# Altium schematic sheet Bridge.SchDoc
size A4; SheetNumber: 2; SheetTotal: 4
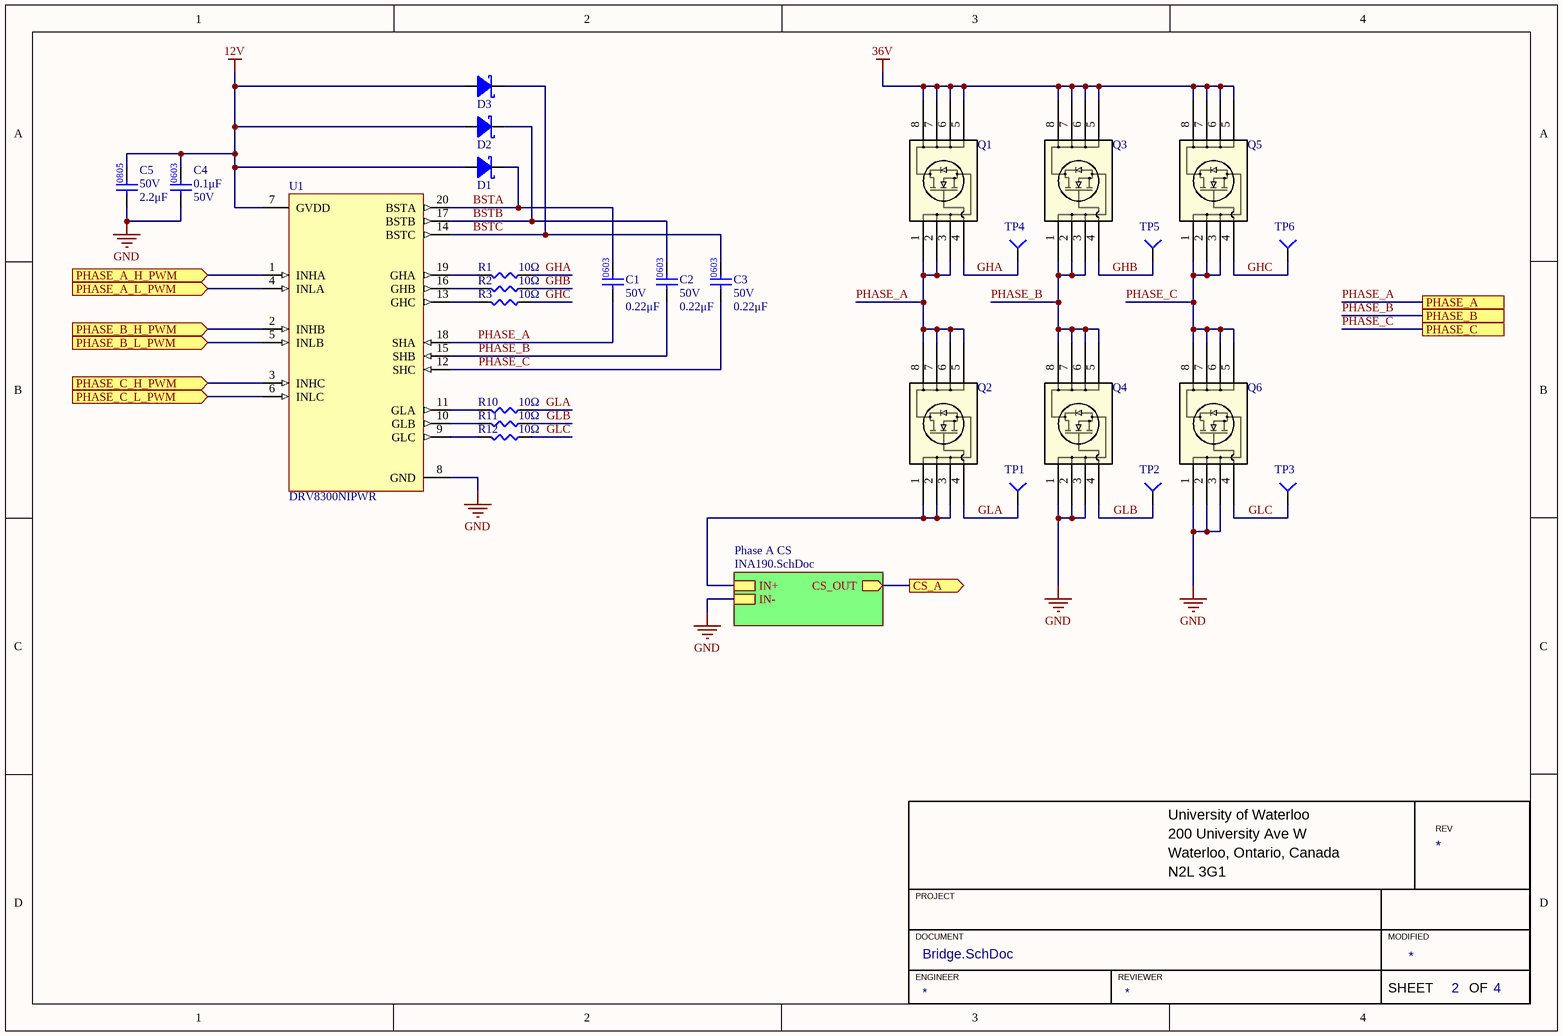
[diagram p0: Bridge.SchDoc]

## Parts
C1  value 0.22μF  Voltage Rating: 50V  [CAP0603]  (hidden comment: CAP_0.22uF_50V_0603)
C2  value 0.22μF  Voltage Rating: 50V  [CAP0603]  (hidden comment: CAP_0.22uF_50V_0603)
C3  value 0.22μF  Voltage Rating: 50V  [CAP0603]  (hidden comment: CAP_0.22uF_50V_0603)
C4  value 0.1μF  Voltage Rating: 50V  [CAP0603]  (hidden comment: CAP_0.1uF_50V_0603)
C5  value 2.2μF  Voltage Rating: 50V  [CAP0805]  (hidden comment: CAP_2.2uF_50V_0805)
D1  DIO_SCHOTTKY_60V_2A  [SOD-123_FLAT]  (value not drawn)
D2  DIO_SCHOTTKY_60V_2A  [SOD-123_FLAT]  (value not drawn)
D3  DIO_SCHOTTKY_60V_2A  [SOD-123_FLAT]  (value not drawn)
Q1  CSD19502Q5B  [DFN5060]  (value not drawn)
Q2  CSD19502Q5B  [DFN5060]  (value not drawn)
Q3  CSD19502Q5B  [DFN5060]  (value not drawn)
Q4  CSD19502Q5B  [DFN5060]  (value not drawn)
Q5  CSD19502Q5B  [DFN5060]  (value not drawn)
Q6  CSD19502Q5B  [DFN5060]  (value not drawn)
R1  value 10Ω  [RES0805]  (hidden comment: RES_10Ω_0805_1%)
R2  value 10Ω  [RES0805]  (hidden comment: RES_10Ω_0805_1%)
R3  value 10Ω  [RES0805]  (hidden comment: RES_10Ω_0805_1%)
R10  value 10Ω  [RES0805]  (hidden comment: RES_10Ω_0805_1%)
R11  value 10Ω  [RES0805]  (hidden comment: RES_10Ω_0805_1%)
R12  value 10Ω  [RES0805]  (hidden comment: RES_10Ω_0805_1%)
TP1  TESTPOINT_1MM_CIRCLE  [TESTPOINT_CIRCLE_1MM]  (value not drawn)  (no BOM)
TP2  TESTPOINT_1MM_CIRCLE  [TESTPOINT_CIRCLE_1MM]  (value not drawn)  (no BOM)
TP3  TESTPOINT_1MM_CIRCLE  [TESTPOINT_CIRCLE_1MM]  (value not drawn)  (no BOM)
TP4  TESTPOINT_1MM_CIRCLE  [TESTPOINT_CIRCLE_1MM]  (value not drawn)  (no BOM)
TP5  TESTPOINT_1MM_CIRCLE  [TESTPOINT_CIRCLE_1MM]  (value not drawn)  (no BOM)
TP6  TESTPOINT_1MM_CIRCLE  [TESTPOINT_CIRCLE_1MM]  (value not drawn)  (no BOM)
U1  DRV8300NIPWR  [20-TSSOP_4400X6500X1200]

## Sub-sheets
Phase A CS = INA190.SchDoc: IN+, IN-, CS_OUT (out)

## Ports
CS_A (out, see Top[3C]), PHASE_A (see Top[3B]), PHASE_A_H_PWM (in, see Top[2B]), PHASE_A_L_PWM (in, see Top[2B]), PHASE_B (see Top[3B]), PHASE_B_H_PWM (in, see Top[2B]), PHASE_B_L_PWM (in, see Top[2B]), PHASE_C (see Top[3B]), PHASE_C_H_PWM (in, see Top[2C]), PHASE_C_L_PWM (in, see Top[2C])

## Nets
12V: C4.2 C5.2 D1.2(Anode) D2.2(Anode) D3.2(Anode) U1.7(GVDD)
36V: Q1.5(D) Q1.6(D) Q1.7(D) Q1.8(D) Q3.5(D) Q3.6(D) Q3.7(D) Q3.8(D) Q5.5(D) Q5.6(D) Q5.7(D) Q5.8(D)
GND: C4.1 C5.1 Q4.1(S) Q4.2(S) Q4.3(S) Q6.1(S) Q6.2(S) Q6.3(S) U1.8(GND) ; sheet Phase A CS/IN-
BSTA: C1.2 D1.1(Cathode) U1.20(BSTA)
BSTB: C2.2 D2.1(Cathode) U1.17(BSTB)
BSTC: C3.2 D3.1(Cathode) U1.14(BSTC)
CS_A: port CS_A, sheet Phase A CS/CS_OUT
GHA: Q1.4(G) R1.2 TP4.1(=value)
GHB: Q3.4(G) R2.2 TP5.1(=value)
GHC: Q5.4(G) R3.2 TP6.1(=value)
GLA: Q2.4(G) R10.2 TP1.1(=value)
GLB: Q4.4(G) R11.2 TP2.1(=value)
GLC: Q6.4(G) R12.2 TP3.1(=value)
PHASE_A: C1.1 Q1.1(S) Q1.2(S) Q1.3(S) Q2.5(D) Q2.6(D) Q2.7(D) Q2.8(D) U1.18(SHA) ; port PHASE_A
PHASE_A_H_PWM: U1.1(INHA) ; port PHASE_A_H_PWM
PHASE_A_L_PWM: U1.4(INLA) ; port PHASE_A_L_PWM
PHASE_B: C2.1 Q3.1(S) Q3.2(S) Q3.3(S) Q4.5(D) Q4.6(D) Q4.7(D) Q4.8(D) U1.15(SHB) ; port PHASE_B
PHASE_B_H_PWM: U1.2(INHB) ; port PHASE_B_H_PWM
PHASE_B_L_PWM: U1.5(INLB) ; port PHASE_B_L_PWM
PHASE_C: C3.1 Q5.1(S) Q5.2(S) Q5.3(S) Q6.5(D) Q6.6(D) Q6.7(D) Q6.8(D) U1.12(SHC) ; port PHASE_C
PHASE_C_H_PWM: U1.3(INHC) ; port PHASE_C_H_PWM
PHASE_C_L_PWM: U1.6(INLC) ; port PHASE_C_L_PWM
NetQ2_1: Q2.1(S) Q2.2(S) Q2.3(S) ; sheet Phase A CS/IN+
NetR1_1: R1.1 U1.19(GHA)
NetR2_1: R2.1 U1.16(GHB)
NetR3_1: R3.1 U1.13(GHC)
NetR10_1: R10.1 U1.11(GLA)
NetR11_1: R11.1 U1.10(GLB)
NetR12_1: R12.1 U1.9(GLC)

## Notes on the sheet
- University of Waterloo
- 200 University Ave W
- REV
- PROJECT
- Waterloo, Ontario, Canada
- N2L 3G1
- DOCUMENT
- ENGINEER
- REVIEWER
- MODIFIED
- SHEET
- OF

## Library data of the parts
C1-C3 = CAP_0.22uF_50V_0603: CAP CER 0.22UF 50V X7R 0603; Manufacturer Part Number 1: UMK107B7224KA-TR; Manufacturer 1: Taiyo Yuden; Mounting Type: SMD; Package: 0603; Dielectric: X7R; Supplier 1: Digi-Key; Supplier Part Number 1: 587-5958-1-ND; LCSC Part #: C5378
C4 = CAP_0.1uF_50V_0603: CAP CER 0.1UF 50V X7R 0603; Manufacturer 1: Yageo; Manufacturer Part Number 1: CC0603KRX7R9BB104; Package/Footprint: 0603; Mounting Type: SMD; Supplier 1: Digi-Key; Supplier Part Number 1: 311-1344-1-ND; Dielectric: X7R
C5 = CAP_2.2uF_50V_0805: CAP CER 2.2UF 50V X5R 0805; Manufacturer Part Number 1: CL21A225KBFNNNE; Manufacturer 1: Samsung Electro-Mechanics; Mounting Type: SMD; Package: 0805; Supplier 1: Digi-Key; Supplier Part Number 1: 1276-6702-1-ND
D1-D3 = DIO_SCHOTTKY_60V_2A: DIODE SCHOTTKY 40V 520MA SOD323; Manufacturer 1: Diodes Incorporated; Manufacturer Part Number 1: B260S1F-7; Package/Footprint: SOD-123F; Mounting Type: SMD; Supplier 1: Digi-Key; Supplier Part Number 1: B260S1F-7DICT-ND
Q1-Q6 = NMOS_CSD19502Q5B_80V_100A: MOSFET N-CH 80V 100A 8VSON; Manufacturer 1: Texas Instruments; Vgs (Max): ±20V; Package/Footprint: 8-PowerTDFN; Supplier 1: Digi-Key; Supplier Part Number 1: 296-37194-1-ND; Vdss (Max): 80V; Id: 100A; Manufacturer Part Number 1: CSD19502Q5B
R1-R3 R10-R12 = RES_10Ω_0805_1%: RES 10 OHM 1% 1/8W 0805; Manufacturer 1: Yageo; Manufacturer Part Number 1: RC0805FR-0710RL; Supplier Part Number 1: 311-10.0CRCT-ND; Supplier 1: Digi-Key; Mounting Type: SMD; LCSC Part #: C17415; Package: 0805
TP1-TP6 = TESTPOINT_1MM_CIRCLE: TESTPOINT 1MM CIRCLE
U1 = DRV8300NIPWR: 100-V MAX SIMPLE 3-PHASE GATE DR; Manufacturer 1: Texas Instruments; Package/Footprint: 20-TSSOP; Supplier 1: Digi-Key; Supplier Part Number 1: 296-DRV8300NIPWRCT-ND; Manufacturer Part Number 1: DRV8300NIPWR